# Altium schematic sheet Crystal.SchDoc
size 53 x 30 mm
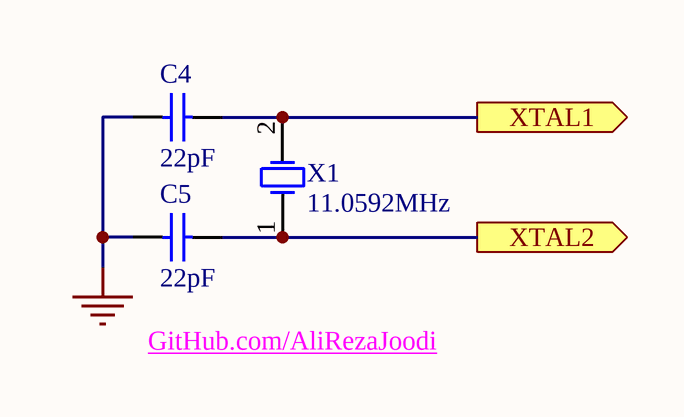
[diagram p0: Crystal.SchDoc]

## Parts
C4  value 22pF  [CAPNTO2.54-3.05x1.78A]  (hidden comment: Cap)
C5  value 22pF  [CAPNTO2.54-3.05x1.78A]  (hidden comment: Cap)
X1  11.0592MHz  [XTAL_1]

## Ports
XTAL1 (out), XTAL2 (out)

## Nets
GND: C4.2 C5.2
XTAL1: C4.1 X1.2(OSC2) ; port XTAL1
XTAL2: C5.1 X1.1(OSC1) ; port XTAL2

## Notes on the sheet
- GitHub.com/AliRezaJoodi

## Library data of the parts
C4 C5 = Cap: Capacitor; Manufacturer: Generic Components; Class I: Passive; Published: 8-Jun-2000; Revision: July-2002: Re-released for DXP Platform.; Publisher: Altium Limited; Class II: Capacitor
X1 = XTAL: Crystal Oscillator; Manufacturer: Generic Components; Published: 8-Jun-2000; Revision: July-2002: Re-released for DXP Platform.; Publisher: Altium Limited; Class I: Oscillator; Class II: Crystal Oscillator